# Altium schematic sheet RGBM-03.SchDoc
size Tabloid; SheetNumber: 3; SheetTotal: 7
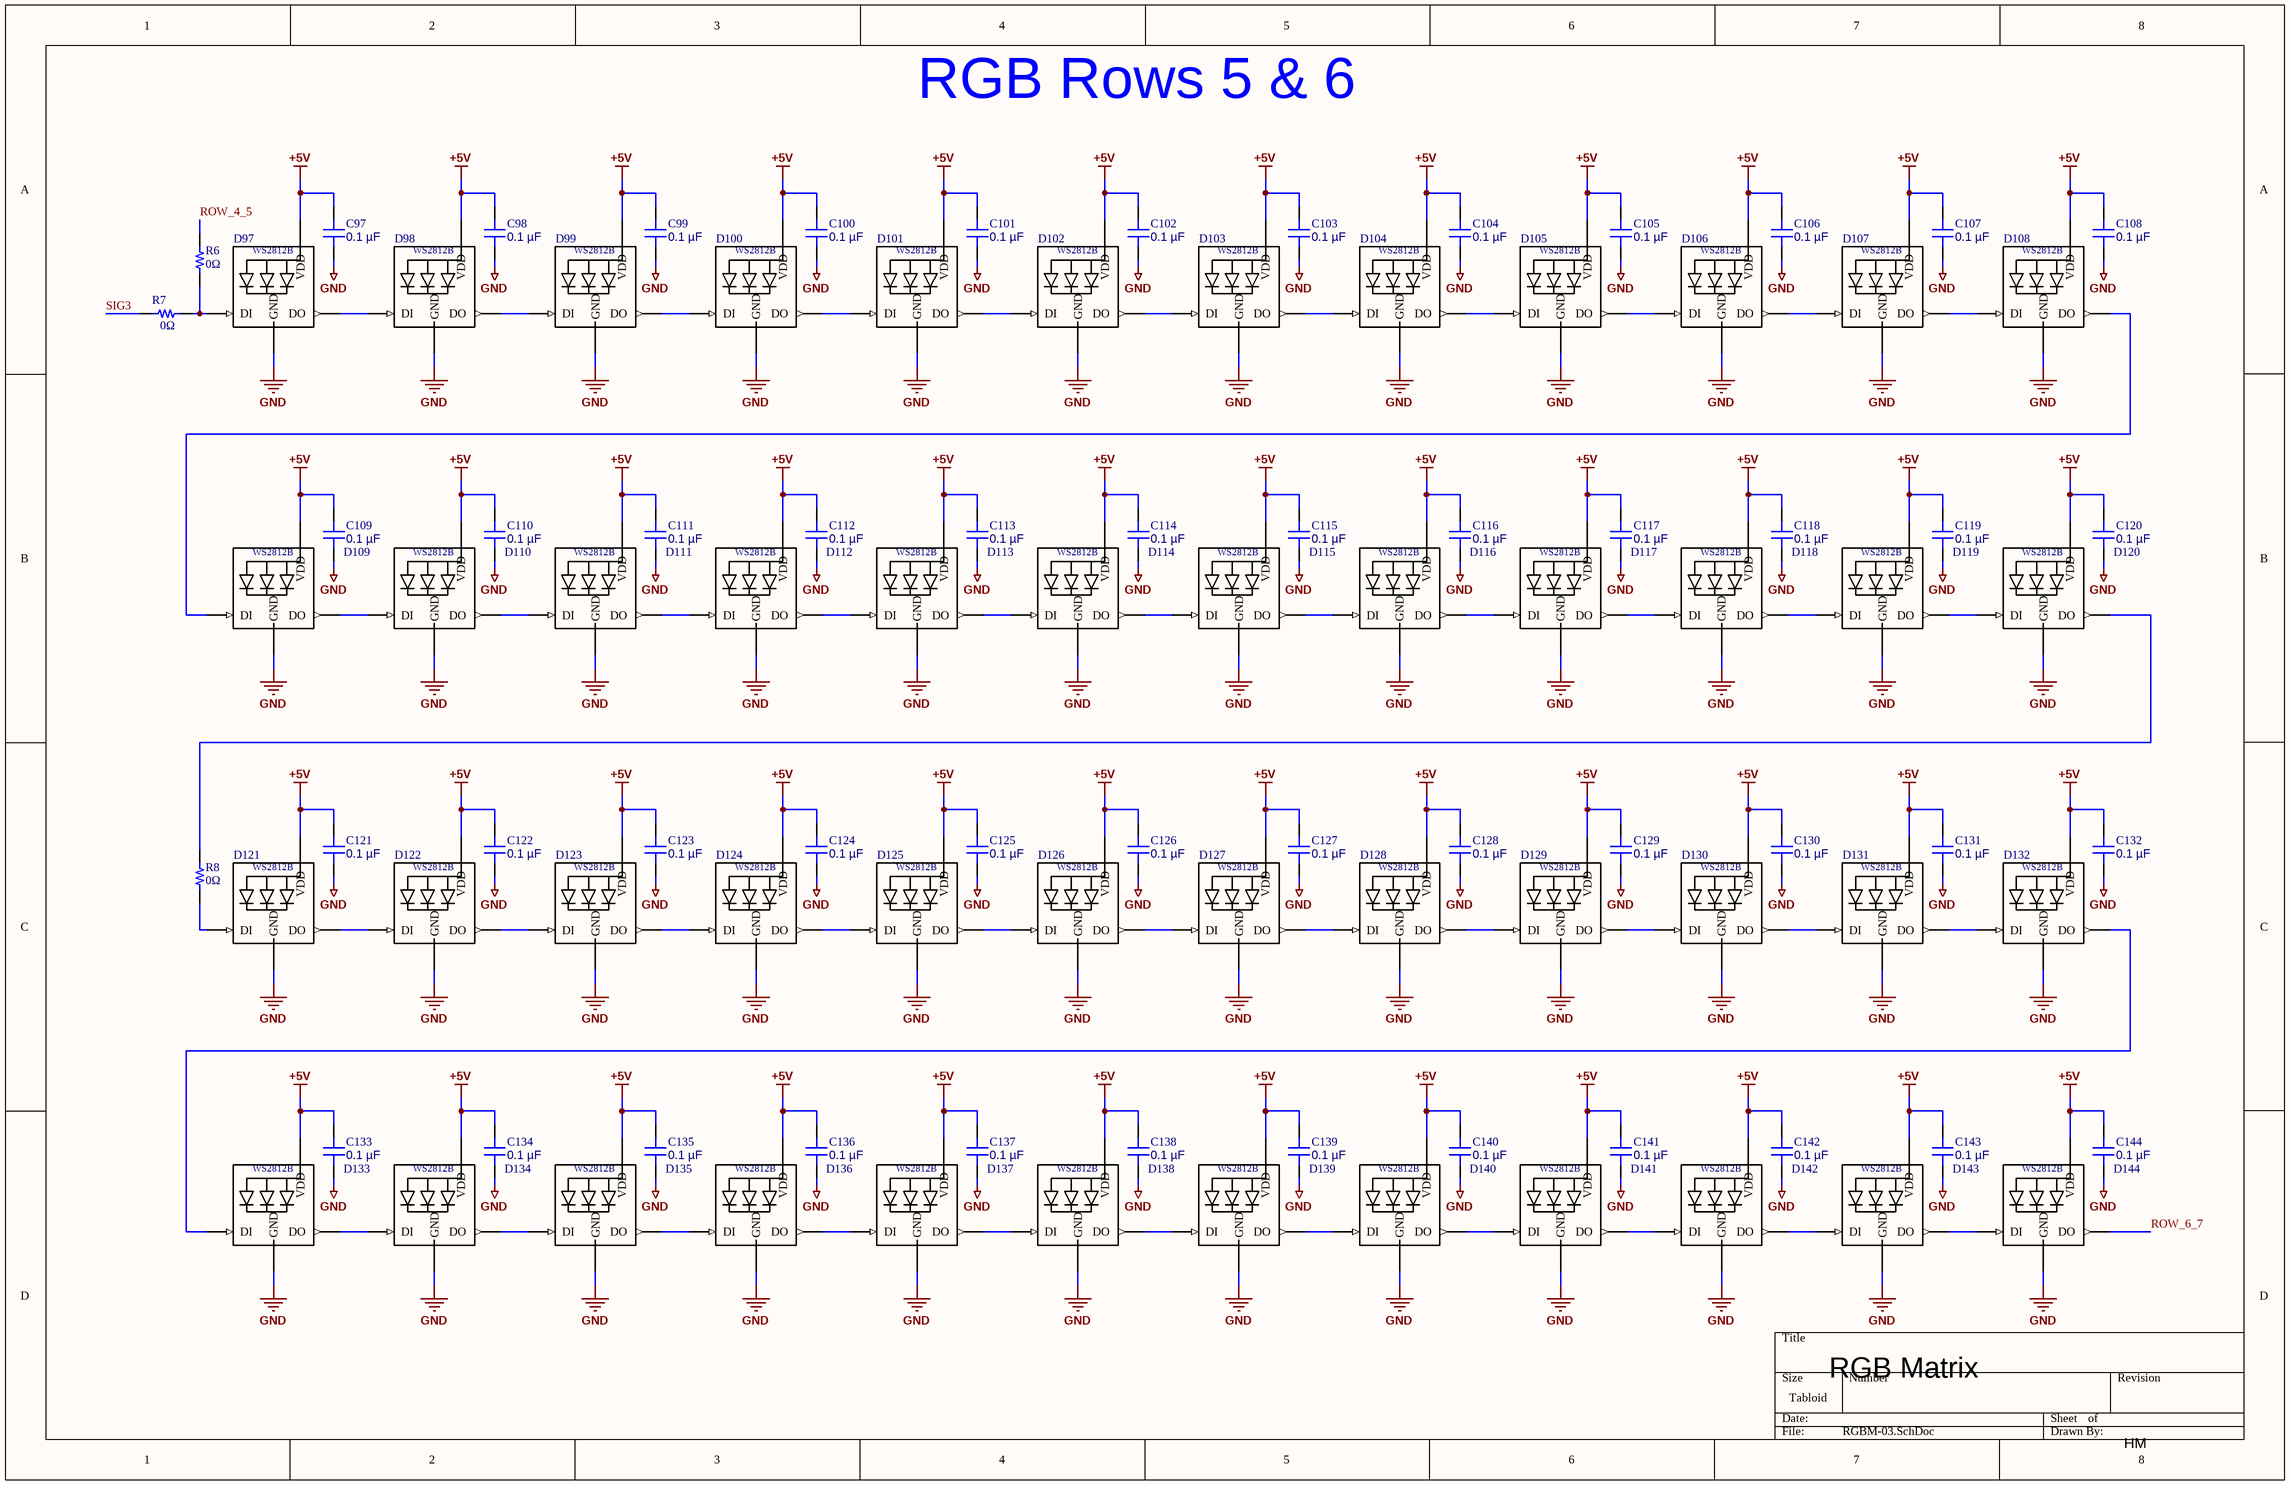
[diagram p0: RGBM-03.SchDoc]

## Parts
C97  0.1 µF  [CAP 0603_1608]
C98  0.1 µF  [CAP 0603_1608]
C99  0.1 µF  [CAP 0603_1608]
C100  0.1 µF  [CAP 0603_1608]
C101  0.1 µF  [CAP 0603_1608]
C102  0.1 µF  [CAP 0603_1608]
C103  0.1 µF  [CAP 0603_1608]
C104  0.1 µF  [CAP 0603_1608]
C105  0.1 µF  [CAP 0603_1608]
C106  0.1 µF  [CAP 0603_1608]
C107  0.1 µF  [CAP 0603_1608]
C108  0.1 µF  [CAP 0603_1608]
C109  0.1 µF  [CAP 0603_1608]
C110  0.1 µF  [CAP 0603_1608]
C111  0.1 µF  [CAP 0603_1608]
C112  0.1 µF  [CAP 0603_1608]
C113  0.1 µF  [CAP 0603_1608]
C114  0.1 µF  [CAP 0603_1608]
C115  0.1 µF  [CAP 0603_1608]
C116  0.1 µF  [CAP 0603_1608]
C117  0.1 µF  [CAP 0603_1608]
C118  0.1 µF  [CAP 0603_1608]
C119  0.1 µF  [CAP 0603_1608]
C120  0.1 µF  [CAP 0603_1608]
C121  0.1 µF  [CAP 0603_1608]
C122  0.1 µF  [CAP 0603_1608]
C123  0.1 µF  [CAP 0603_1608]
C124  0.1 µF  [CAP 0603_1608]
C125  0.1 µF  [CAP 0603_1608]
C126  0.1 µF  [CAP 0603_1608]
C127  0.1 µF  [CAP 0603_1608]
C128  0.1 µF  [CAP 0603_1608]
C129  0.1 µF  [CAP 0603_1608]
C130  0.1 µF  [CAP 0603_1608]
C131  0.1 µF  [CAP 0603_1608]
C132  0.1 µF  [CAP 0603_1608]
C133  0.1 µF  [CAP 0603_1608]
C134  0.1 µF  [CAP 0603_1608]
C135  0.1 µF  [CAP 0603_1608]
C136  0.1 µF  [CAP 0603_1608]
C137  0.1 µF  [CAP 0603_1608]
C138  0.1 µF  [CAP 0603_1608]
C139  0.1 µF  [CAP 0603_1608]
C140  0.1 µF  [CAP 0603_1608]
C141  0.1 µF  [CAP 0603_1608]
C142  0.1 µF  [CAP 0603_1608]
C143  0.1 µF  [CAP 0603_1608]
C144  0.1 µF  [CAP 0603_1608]
D97  WS2812B  [*WS2812B_WS2812B(Primary)]  (value not drawn)
D98  WS2812B  [*WS2812B_WS2812B(Primary)]  (value not drawn)
D99  WS2812B  [*WS2812B_WS2812B(Primary)]  (value not drawn)
D100  WS2812B  [*WS2812B_WS2812B(Primary)]  (value not drawn)
D101  WS2812B  [*WS2812B_WS2812B(Primary)]  (value not drawn)
D102  WS2812B  [*WS2812B_WS2812B(Primary)]  (value not drawn)
D103  WS2812B  [*WS2812B_WS2812B(Primary)]  (value not drawn)
D104  WS2812B  [*WS2812B_WS2812B(Primary)]  (value not drawn)
D105  WS2812B  [*WS2812B_WS2812B(Primary)]  (value not drawn)
D106  WS2812B  [*WS2812B_WS2812B(Primary)]  (value not drawn)
D107  WS2812B  [*WS2812B_WS2812B(Primary)]  (value not drawn)
D108  WS2812B  [*WS2812B_WS2812B(Primary)]  (value not drawn)
D109  WS2812B  [*WS2812B_WS2812B(Primary)]  (value not drawn)
D110  WS2812B  [*WS2812B_WS2812B(Primary)]  (value not drawn)
D111  WS2812B  [*WS2812B_WS2812B(Primary)]  (value not drawn)
D112  WS2812B  [*WS2812B_WS2812B(Primary)]  (value not drawn)
D113  WS2812B  [*WS2812B_WS2812B(Primary)]  (value not drawn)
D114  WS2812B  [*WS2812B_WS2812B(Primary)]  (value not drawn)
D115  WS2812B  [*WS2812B_WS2812B(Primary)]  (value not drawn)
D116  WS2812B  [*WS2812B_WS2812B(Primary)]  (value not drawn)
D117  WS2812B  [*WS2812B_WS2812B(Primary)]  (value not drawn)
D118  WS2812B  [*WS2812B_WS2812B(Primary)]  (value not drawn)
D119  WS2812B  [*WS2812B_WS2812B(Primary)]  (value not drawn)
D120  WS2812B  [*WS2812B_WS2812B(Primary)]  (value not drawn)
D121  WS2812B  [*WS2812B_WS2812B(Primary)]  (value not drawn)
D122  WS2812B  [*WS2812B_WS2812B(Primary)]  (value not drawn)
D123  WS2812B  [*WS2812B_WS2812B(Primary)]  (value not drawn)
D124  WS2812B  [*WS2812B_WS2812B(Primary)]  (value not drawn)
D125  WS2812B  [*WS2812B_WS2812B(Primary)]  (value not drawn)
D126  WS2812B  [*WS2812B_WS2812B(Primary)]  (value not drawn)
D127  WS2812B  [*WS2812B_WS2812B(Primary)]  (value not drawn)
D128  WS2812B  [*WS2812B_WS2812B(Primary)]  (value not drawn)
D129  WS2812B  [*WS2812B_WS2812B(Primary)]  (value not drawn)
D130  WS2812B  [*WS2812B_WS2812B(Primary)]  (value not drawn)
D131  WS2812B  [*WS2812B_WS2812B(Primary)]  (value not drawn)
D132  WS2812B  [*WS2812B_WS2812B(Primary)]  (value not drawn)
D133  WS2812B  [*WS2812B_WS2812B(Primary)]  (value not drawn)
D134  WS2812B  [*WS2812B_WS2812B(Primary)]  (value not drawn)
D135  WS2812B  [*WS2812B_WS2812B(Primary)]  (value not drawn)
D136  WS2812B  [*WS2812B_WS2812B(Primary)]  (value not drawn)
D137  WS2812B  [*WS2812B_WS2812B(Primary)]  (value not drawn)
D138  WS2812B  [*WS2812B_WS2812B(Primary)]  (value not drawn)
D139  WS2812B  [*WS2812B_WS2812B(Primary)]  (value not drawn)
D140  WS2812B  [*WS2812B_WS2812B(Primary)]  (value not drawn)
D141  WS2812B  [*WS2812B_WS2812B(Primary)]  (value not drawn)
D142  WS2812B  [*WS2812B_WS2812B(Primary)]  (value not drawn)
D143  WS2812B  [*WS2812B_WS2812B(Primary)]  (value not drawn)
D144  WS2812B  [*WS2812B_WS2812B(Primary)]  (value not drawn)
R6  0Ω  [RES 0603_1608]
R7  0Ω  [RES 0603_1608]
R8  0Ω  [RES 0603_1608]

## Nets
+5V: C97.2 C98.2 C99.2 C100.2 C101.2 C102.2 C103.2 C104.2 C105.2 C106.2 C107.2 C108.2 C109.2 C110.2 C111.2 C112.2 C113.2 C114.2 C115.2 C116.2 C117.2 C118.2 C119.2 C120.2 C121.2 C122.2 C123.2 C124.2 C125.2 C126.2 C127.2 C128.2 C129.2 C130.2 C131.2 C132.2 C133.2 C134.2 C135.2 C136.2 C137.2 C138.2 C139.2 C140.2 C141.2 C142.2 C143.2 C144.2 D97.1-VDD(VDD) D98.1-VDD(VDD) D99.1-VDD(VDD) D100.1-VDD(VDD) D101.1-VDD(VDD) D102.1-VDD(VDD) D103.1-VDD(VDD) D104.1-VDD(VDD) D105.1-VDD(VDD) D106.1-VDD(VDD) D107.1-VDD(VDD) D108.1-VDD(VDD) D109.1-VDD(VDD) D110.1-VDD(VDD) D111.1-VDD(VDD) D112.1-VDD(VDD) D113.1-VDD(VDD) D114.1-VDD(VDD) D115.1-VDD(VDD) D116.1-VDD(VDD) D117.1-VDD(VDD) D118.1-VDD(VDD) D119.1-VDD(VDD) D120.1-VDD(VDD) D121.1-VDD(VDD) D122.1-VDD(VDD) D123.1-VDD(VDD) D124.1-VDD(VDD) D125.1-VDD(VDD) D126.1-VDD(VDD) D127.1-VDD(VDD) D128.1-VDD(VDD) D129.1-VDD(VDD) D130.1-VDD(VDD) D131.1-VDD(VDD) D132.1-VDD(VDD) D133.1-VDD(VDD) D134.1-VDD(VDD) D135.1-VDD(VDD) D136.1-VDD(VDD) D137.1-VDD(VDD) D138.1-VDD(VDD) D139.1-VDD(VDD) D140.1-VDD(VDD) D141.1-VDD(VDD) D142.1-VDD(VDD) D143.1-VDD(VDD) D144.1-VDD(VDD)
GND: C97.1 C98.1 C99.1 C100.1 C101.1 C102.1 C103.1 C104.1 C105.1 C106.1 C107.1 C108.1 C109.1 C110.1 C111.1 C112.1 C113.1 C114.1 C115.1 C116.1 C117.1 C118.1 C119.1 C120.1 C121.1 C122.1 C123.1 C124.1 C125.1 C126.1 C127.1 C128.1 C129.1 C130.1 C131.1 C132.1 C133.1 C134.1 C135.1 C136.1 C137.1 C138.1 C139.1 C140.1 C141.1 C142.1 C143.1 C144.1 D97.3-GND(GND) D98.3-GND(GND) D99.3-GND(GND) D100.3-GND(GND) D101.3-GND(GND) D102.3-GND(GND) D103.3-GND(GND) D104.3-GND(GND) D105.3-GND(GND) D106.3-GND(GND) D107.3-GND(GND) D108.3-GND(GND) D109.3-GND(GND) D110.3-GND(GND) D111.3-GND(GND) D112.3-GND(GND) D113.3-GND(GND) D114.3-GND(GND) D115.3-GND(GND) D116.3-GND(GND) D117.3-GND(GND) D118.3-GND(GND) D119.3-GND(GND) D120.3-GND(GND) D121.3-GND(GND) D122.3-GND(GND) D123.3-GND(GND) D124.3-GND(GND) D125.3-GND(GND) D126.3-GND(GND) D127.3-GND(GND) D128.3-GND(GND) D129.3-GND(GND) D130.3-GND(GND) D131.3-GND(GND) D132.3-GND(GND) D133.3-GND(GND) D134.3-GND(GND) D135.3-GND(GND) D136.3-GND(GND) D137.3-GND(GND) D138.3-GND(GND) D139.3-GND(GND) D140.3-GND(GND) D141.3-GND(GND) D142.3-GND(GND) D143.3-GND(GND) D144.3-GND(GND)
ROW_4_5: R6.2
ROW_6_7: D144.2-DOUT(DO)
SIG3: R7.1
NetD97_2-DOUT: D97.2-DOUT(DO) D98.4-DIN(DI)
NetD97_4-DIN: D97.4-DIN(DI) R6.1 R7.2
NetD98_2-DOUT: D98.2-DOUT(DO) D99.4-DIN(DI)
NetD99_2-DOUT: D99.2-DOUT(DO) D100.4-DIN(DI)
NetD100_2-DOUT: D100.2-DOUT(DO) D101.4-DIN(DI)
NetD101_2-DOUT: D101.2-DOUT(DO) D102.4-DIN(DI)
NetD102_2-DOUT: D102.2-DOUT(DO) D103.4-DIN(DI)
NetD103_2-DOUT: D103.2-DOUT(DO) D104.4-DIN(DI)
NetD104_2-DOUT: D104.2-DOUT(DO) D105.4-DIN(DI)
NetD105_2-DOUT: D105.2-DOUT(DO) D106.4-DIN(DI)
NetD106_2-DOUT: D106.2-DOUT(DO) D107.4-DIN(DI)
NetD107_2-DOUT: D107.2-DOUT(DO) D108.4-DIN(DI)
NetD108_2-DOUT: D108.2-DOUT(DO) D109.4-DIN(DI)
NetD109_2-DOUT: D109.2-DOUT(DO) D110.4-DIN(DI)
NetD110_2-DOUT: D110.2-DOUT(DO) D111.4-DIN(DI)
NetD111_2-DOUT: D111.2-DOUT(DO) D112.4-DIN(DI)
NetD112_2-DOUT: D112.2-DOUT(DO) D113.4-DIN(DI)
NetD113_2-DOUT: D113.2-DOUT(DO) D114.4-DIN(DI)
NetD114_2-DOUT: D114.2-DOUT(DO) D115.4-DIN(DI)
NetD115_2-DOUT: D115.2-DOUT(DO) D116.4-DIN(DI)
NetD116_2-DOUT: D116.2-DOUT(DO) D117.4-DIN(DI)
NetD117_2-DOUT: D117.2-DOUT(DO) D118.4-DIN(DI)
NetD118_2-DOUT: D118.2-DOUT(DO) D119.4-DIN(DI)
NetD119_2-DOUT: D119.2-DOUT(DO) D120.4-DIN(DI)
NetD120_2-DOUT: D120.2-DOUT(DO) R8.2
NetD121_2-DOUT: D121.2-DOUT(DO) D122.4-DIN(DI)
NetD121_4-DIN: D121.4-DIN(DI) R8.1
NetD122_2-DOUT: D122.2-DOUT(DO) D123.4-DIN(DI)
NetD123_2-DOUT: D123.2-DOUT(DO) D124.4-DIN(DI)
NetD124_2-DOUT: D124.2-DOUT(DO) D125.4-DIN(DI)
NetD125_2-DOUT: D125.2-DOUT(DO) D126.4-DIN(DI)
NetD126_2-DOUT: D126.2-DOUT(DO) D127.4-DIN(DI)
NetD127_2-DOUT: D127.2-DOUT(DO) D128.4-DIN(DI)
NetD128_2-DOUT: D128.2-DOUT(DO) D129.4-DIN(DI)
NetD129_2-DOUT: D129.2-DOUT(DO) D130.4-DIN(DI)
NetD130_2-DOUT: D130.2-DOUT(DO) D131.4-DIN(DI)
NetD131_2-DOUT: D131.2-DOUT(DO) D132.4-DIN(DI)
NetD132_2-DOUT: D132.2-DOUT(DO) D133.4-DIN(DI)
NetD133_2-DOUT: D133.2-DOUT(DO) D134.4-DIN(DI)
NetD134_2-DOUT: D134.2-DOUT(DO) D135.4-DIN(DI)
NetD135_2-DOUT: D135.2-DOUT(DO) D136.4-DIN(DI)
NetD136_2-DOUT: D136.2-DOUT(DO) D137.4-DIN(DI)
NetD137_2-DOUT: D137.2-DOUT(DO) D138.4-DIN(DI)
NetD138_2-DOUT: D138.2-DOUT(DO) D139.4-DIN(DI)
NetD139_2-DOUT: D139.2-DOUT(DO) D140.4-DIN(DI)
NetD140_2-DOUT: D140.2-DOUT(DO) D141.4-DIN(DI)
NetD141_2-DOUT: D141.2-DOUT(DO) D142.4-DIN(DI)
NetD142_2-DOUT: D142.2-DOUT(DO) D143.4-DIN(DI)
NetD143_2-DOUT: D143.2-DOUT(DO) D144.4-DIN(DI)

## Notes on the sheet
- RGB Rows 5 & 6
- RGB Matrix
- HM

## Library data of the parts
C97-C144 = C0603C104K5RAC7411: CAP CER 0.1UF 50V X7R 0603; manufacturer: KEMET; Tolerance: ±10%; Part Number: C0603C104K5RAC7411; Capacitance: 0.1 µF; Applications: Bypass, Decoupling; componentlink1description: Datasheet; componentlink1url: https://api.kemet.com/component-edge/download/datasheet/C0603C104K5RAC7411.pdf; componentlink2description: DigiKey Link; componentlink2url: https://www.digikey.com/en/products/detail/kemet/C0603C104K5RAC7411/3317013; Device Package: 0603 (1608 Metric); lastupdated: 2026-04-06 7:23:52 PM; Lifecycle Status: Active; Minimum Order: 1; Mounting Type: Surface Mount, MLCC; Operating Temperature: -55°C ~ 125°C; Package / Case: 0603 (1608 Metric); packaging: TapeAndReel; partid: 2233; Part Status: Active; price: 0.01; series: SMD Comm X7R; Size / Dimension: 0.063" L x 0.031" W (1.60mm x 0.80mm); Supplier 1: DigiKey; Supplier Part Number 1: 399-C0603C104K5RAC7411CT-ND; Temperature Coefficient: X7R; Thickness (Max): 0.035" (0.90mm); value: 0.1 µF; Voltage - Rated: 50V
D97-D144 = WS2812B: Intelligent control LED integrated light source; MF: Worldsemi; SnapEDA_Link: https://www.snapeda.com/parts/WS2812B/Worldsemi/view-part/?ref=snap; Package: None; MP: WS2812B; Check_prices: https://www.snapeda.com/parts/WS2812B/Worldsemi/view-part/?ref=eda; Value: *
R6-R8 = YJP1608-R001: RES SMD 0 OHM JUMPER 0603; Manufacturer: Susumu; Value: 0 Ohms; Part Number: YJP1608-R001; ComponentLink1Description: Datasheet; ComponentLink1URL: http://www.susumu.co.jp/common/pdf/n_catalog_partition10_en.pdf; ComponentLink2Description: DigiKey Link; ComponentLink2URL: https://www.digikey.com/en/products/detail/susumu/YJP1608-R001/2815047; Composition: Thin Film; Device Package: 0603 (1608 Metric); Height - Seated (Max): 0.016" (0.40mm); LastUpdated: 2024-02-09 8:42:50 PM; Lifecycle Status: Active; Minimum Order: 1; Number of Terminations: 2; Operating Temperature: -40°C ~ 125°C; Package / Case: 0603 (1608 Metric); Packaging: TapeAndReel; PartId: 16802; Part Status: Active; Price: 0.08; Resistance: 0 Ohms; Series: YJP; Size / Dimension: 0.063" L x 0.031" W (1.60mm x 0.80mm); Supplier 1: DigiKey; Supplier Part Number 1: 408-1515-1-ND; Supplier Device Package: 0603; Tolerance: Jumper